# Altium project PDB_Core_6S2P_v1.6.PrjPcb
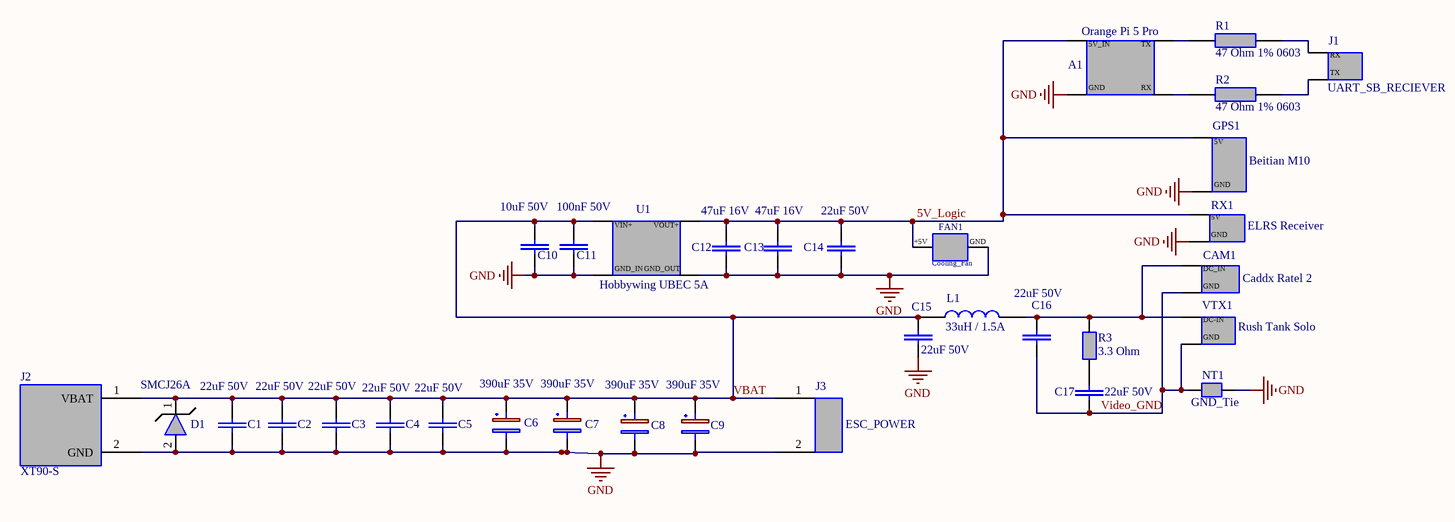
[diagram p0: PDB_Schematic_v1.0.SchDoc]
1 sheet, 33 parts. Net scope: global (net labels, ports and power ports of the same name join across sheets).
Board file: PDB_Layout_2oz_v1.0.PcbDoc

## Sheet PDB_Schematic_v1.0.SchDoc
size A4; SheetNumber: 1; SheetTotal: 1

### Parts
A1  Orange Pi 5 Pro  [FOOTPRINT_ORANGE_PI]
C1  22uF 50V  [1210]
C2  22uF 50V  [1210]
C3  22uF 50V  [1210]
C4  22uF 50V  [1210]
C5  22uF 50V  [1210]
C6  390uF 35V  [CAP_ELEC_D10.0_P5.0]
C7  390uF 35V  [CAP_ELEC_D10.0_P5.0]
C8  390uF 35V  [CAP_ELEC_D10.0_P5.0]
C9  390uF 35V  [CAP_ELEC_D10.0_P5.0]
C10  10uF 50V  [1206]
C11  100nF 50V  [0603]
C12  47uF 16V  [1210]
C13  47uF 16V  [1210]
C14  22uF 50V  [1210]
C15  22uF 50V  [1210]
C16  22uF 50V  [1210]
C17  22uF 50V  [1206]
CAM1  Caddx Ratel 2  [FOOTPRINT_Caddx_Ratel_2]
D1  SMCJ26A  [DIODE_SMC]
FAN1  Cooling_Fan  [FOOTPRINT_FAN_5V]
GPS1  Beitian M10  [FOOTPRINT_BEITIAN_M10]
J1  UART_SB_RECIEVER  [UART_SPEEDYBEE_RECIEVER]
J2  XT90-S  [XT90-S_PWR]
J3  ESC_POWER  [PADS_ESC_PWR]
L1  33uH / 1.5A  [FOOTPRINT_INDUCTOR_SRN6045]
NT1  GND_Tie  [NET_TIE_0.2MM]  (net tie, no BOM)
R1  47 Ohm 1% 0603  [0603]
R2  47 Ohm 1% 0603  [0603]
R3  3.3 Ohm  [0603]
RX1  ELRS Receiver  [FOOTPRINT_ELRS_RX]
U1  Hobbywing UBEC 5A  [UBEC_Hobbywing_5A]
VTX1  Rush Tank Solo  [FOOTPRINT_VTX_RUSH_SOLO]

### Nets
GND: A1.2(GND) C1.1(+) C2.1(+) C3.1(+) C4.1(+) C5.1(+) C6.2(-) C7.2(-) C8.2(-) C9.2(-) C10.1(+) C11.1(+) C12.1(+) C13.1(+) C14.1(+) C15.1(+) D1.2(A) FAN1.2(GND) GPS1.2(GND) J2.2(GND) J3.2 NT1.1(GND) RX1.2(GND) U1.3(GND_IN) U1.4(GND_OUT)
5V_Logic: A1.1(5V_IN) C12.2(-) C13.2(-) C14.2(-) FAN1.1(+5V) GPS1.1(5V) RX1.1(5V) U1.2(+5.1V)
VBAT: C1.2(-) C2.2(-) C3.2(-) C4.2(-) C5.2(-) C6.1(+) C7.1(+) C8.1(+) C9.1(+) C10.2(-) C11.2(-) C15.2(-) D1.1(k) J2.1(VBAT) J3.1 L1.1 U1.1(VIN+)
Video_GND: C16.1(+) C17.1(+) CAM1.2(GND) NT1.2(Video_GND) VTX1.2(GND)
NetA1_3: A1.3(+5.1V) R1.1
NetA1_4: A1.4(RX) R2.1
NetC16_2: C16.2(-) CAM1.1(DC_IN) L1.2 R3.2 VTX1.1((7-36V))
NetC17_2: C17.2(-) R3.1
NetJ1_1: J1.1(RX) R1.2
NetJ1_2: J1.2(TX) R2.2

### Notes on the sheet
- (in symbol Orange Pi 5 Pro) TX
- (in symbol UBEC_Hobbywing_5A) VOUT+

### Library data of the parts
C1-C3 C5 = Cap_MLCC: Multilayer Ceramic Capacitor (MLCC), 22uF 50V, X7R, 1210 (3225 Metric), High-Frequency ESC Filter. GRM32ER71H226ME14L
C4 C15 C16 = Cap_Cer_22uF_50V: Multilayer Ceramic Capacitor (MLCC), 22uF 50V, X7R, 1210 (3225 Metric), High-Frequency ESC Filter. GRM32ER71H226ME14L
C6-C9 = Cap_Low_ESR: Low ESR Aluminum Electrolytic Capacitor, Panasonic FR Series, 390uF 35V, Radial, 5mm Lead Pitc; Part Number: EEU-FR1V391L; Value: 390uF; Voltage: 35V; Manufacturer: Panasonic
C10 = Cap_Cer_10uF_50V_1206: Ceramic Capacitor, 10 uF, 50 V, X7R Dielectric, 1206 SMD, UBEC VIN Buffer
C11 = Cap_Cer_100nF_50V_0603: High-Frequency Ceramic Capacitor, 100 nF, 50 V, X7R Dielectric, 0603 SMD, UBEC VIN Decoupling
C12 C13 = Cap_Cer_47uF_16V: Capacitor MLCC 47uF 16V X7R 1210 / GRM32ER71C476KE15L
C14 = Cap_MLCC: Multilayer Ceramic Capacitor (MLCC), 22uF 50V, X7R, 1210 (3225 Metric), High-Frequency ESC Filter
C17 = Cap_Cer_22uF_50V_1206: Capacitor MLCC 22uF 50V ±20% X7R 1206 (3216 Metric)
CAM1 = Caddx Ratel 2: Analog FPV Micro Camera, 1200TVL, Ultra Low Light Starlight
D1 = SMCJ26A: Transient Voltage Suppressor (TVS) Diode, Unidirectional, 26V Vrwm, 1500W Peak, DO-214AB (SMC)
FAN1 = Cooling Fan 5V: V DC Micro Cooling Fan, 25x25x10mm Active Cooling
GPS1 = Beitian M10: GNSS GPS + Compass Module, M10 Platform, UART & I2C Interface
J1 = UART_SPEEDYBEE_RECIEVER
J2 = XT90-S: High-Current DC Power Connector with Integrated Anti-Spark Resistance, Amass XT90-S, 90A Peak
J3 = PADS_WIRE_1X2: Wire-to-Board Solder Pads Array, 1x2, 2.54mm Pitch
L1 = Inductor_SMD: Semi-Shielded Power Inductor, Bourns SRN6045 Series, 33uH 2.5A, 0.15 Ohm DCR, LC Video Filter; Manufacturer Part Number: SRN6045-330M; Value: 33uH; Manufacturer: Bourns; Current: 2.5A; DCR: 0.15 Ohm; Package: 6045 SMD
NT1 = NET_TIE: Net-Tie zero-ohm bridge for ground separation
R1 R2 = Res_SMD: Thick Film Chip Resistor, Yageo RC Series, 47 Ohm 1%, 0.1W (100mW), 0603 (1608 Metric), UART Protection; Part Number: RC0603FR-0747RL; Manufacturer: Yageo
R3 = Res_3.3Ohm_0603: Resistor SMD 3.3 Ohm 1% 1/10W (0.1W) 0603 Thick Film
RX1 = ExpressLRS RX: ExpressLRS 2.4GHz True Diversity Radio Receiver Module
U1 = UBEC_Hobbywing_5A: External Step-Down Switching Voltage Regulator Module, Hobbywing UBEC 5A, 2-6S LiPo Input, 5V/6V Selectable Output; Part Number: HW30607000; Input Voltage: 2-8S LiPo (5.5V - 33.6V); Output Voltage: 5.0V / 6.0V / 7.4V; Peak Current: 15A; Manufacturer: Hobbywing; Continuous Current: 5A; Type: Step-Down (Buck) DC-DC
VTX1 = Rush Tank Solo 1.6W: 5.8GHz VTX 1.6W Video Transmitter Module